# Altium schematic sheet 上电唤醒_Max706.SchDoc
size A4; DocumentNumber: 4; SheetNumber: 4; SheetTotal: 34
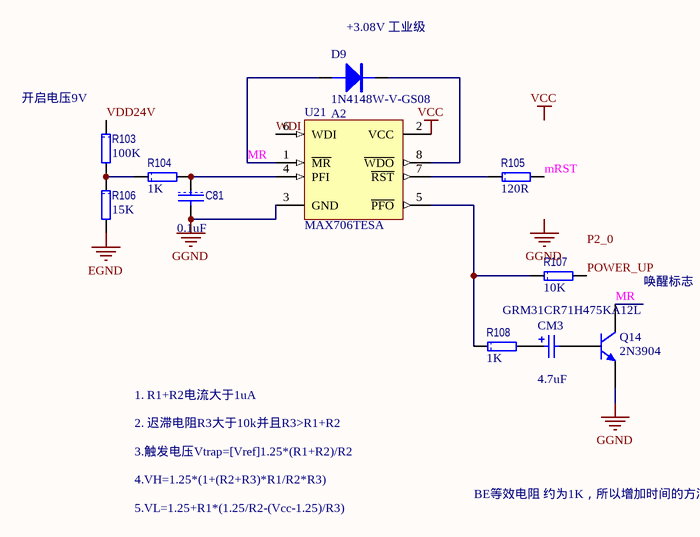
[diagram p0: 上电唤醒_Max706.SchDoc]

## Parts
C81  value 0.1uF  [1608[0603]C]  (hidden comment: C1608X7R1H104K)
CM3  GRM31CR71H475KA12L  value 4.7uF  [3216[1206]C]
D9  1N4148W-V-GS08  value A2  [SOD123]
Q14  2N3904  [SOT23_N]
R103  value 100K  [1608[0603]R]  (hidden comment: CRCW0603100KFKEA)
R104  value 1K  [1608[0603]R]  (hidden comment: CRCW06031K00FKEA)
R105  value 120R  [1608[0603]R]  (hidden comment: CRCW0603120RFKEA)
R106  value 15K  [1608[0603]R]  (hidden comment: CRCW060315K0FKEA)
R107  value 10K  [1608[0603]R]  (hidden comment: CRCW060310KFKEA)
R108  value 1K  [1608[0603]R]  (hidden comment: CRCW06031K00FKEA)
U21  MAX706TESA  [NSO8_N]

## Nets
EGND: R106.2
GGND: C81.2 Q14.1(E) U21.3(GND)
VCC: U21.2(VCC)
MR: D9.1(A) Q14.3(C) U21.1(~{MR})
mRST: R105.2
POWER_UP: R107.2
VDD24V: R103.1
WDI: U21.6(WDI)
NetC81_1: C81.1 R104.2 U21.4(PFI)
NetCM3_1: CM3.1 R108.2
NetCM3_2: CM3.2 Q14.2(B)
NetD9_2: D9.2(K) U21.8(~{WDO})
NetR103_2: R103.2 R104.1 R106.1
NetR105_1: R105.1 U21.7(~{RST})
NetR107_1: R107.1 R108.1 U21.5(~{PFO})

## Notes on the sheet
- (near D9) +3.08V 工业级
- (near R103) 开启电压9V
- 唤醒标志
- 1. R1+R2电流大于1uA
- 2. 迟滞电阻R3大于10k并且R3>R1+R2
- 3.触发电压Vtrap=[Vref]1.25*(R1+R2)/R2
- 4.VH=1.25*(1+(R2+R3)*R1/R2*R3)
- 5.VL=1.25+R1*(1.25/R2-(Vcc-1.25)/R3)
- BE等效电阻 约为1K，所以增加时间的方法只能同过增大电容
- Labels drawn without touching a wire or pin: GGND, P2_0, VCC

## Library data of the parts
C81 = CAP: 多层陶瓷电容器MLCC - SMD/SMT 0603 0.1uF 50volts X7R 10%; Manufacturer: TDK; 产品: General Type MLCCs; 产品种类: Low & Medium Capacitance SMD Ceramic Chip Capacitors; 外壳代码 - in: 0603; 外壳代码 - mm: 1608; 封装 / 箱体: 0603 (1608 metric); 封装: Reel; 尺寸: 0.8 mm W x 1.6 mm L x 0.8 mm H; 工作温度范围: - 55 C to + 125 C; 标准包装数量: 4000; 电压额定值: 50 V; 电容-nF: 100 nF; 电容-pF: 100000 pF; 系列: C; Category: 多层陶瓷电容器MLCC - SMD/SMT; ComponentLink1Description: http://www.tdk.com/pdf/general_B11.pdf; ComponentLink1URL: http://www.tdk.com/pdf/general_B11.pdf; Description 1: 多层陶瓷电容器MLCC - SMD/SMT 0603 0.1uF 50volts X7R 10%; Manufacturer Part Number: C1608X7R1H104K; Minimum Order Quantity: 1; Pricing 1: 1=0.160, 50=0.070, 100=0.036, 500=0.019, 1000=0.013, 4000=0.010, 8000=0.009, 12000=0.008, 20000=0.007 (USD); Reeling: True; RoHS - 贸泽: Y; RoHS: RoHS Compliant; Stock 1: 224604; Supplier 1: Mouser; Supplier Part Number 1: 810-C1608X7R1H104K; 制造商: TDK; 容差: 10 %; 温度系数/代码: X7R; 电容: 0.1 uF; 端接类型: SMD/SMT
CM3 = Cap Pol2: 多层陶瓷电容器MLCC - SMD/SMT 4.7uF 50Volts 10%; Manufacturer: Murata Electronics; 尺寸: 1.6 mm W x 3.2 mm L x 1.6 mm H; 工作温度范围: - 55 C to + 125 C; 封装 / 箱体: 1206 (3216 metric); 封装: Reel; 产品: General Type MLCCs; 系列: GRM; 电压额定值: 50 V; 电容-nF: 4700 nF; 外壳代码 - in: 1206; 外壳代码 - mm: 3216; 制造商: Murata; 标准包装数量: 2000; 温度系数/代码: X7R; Supplier 1: Mouser; Supplier Part Number 1: 81-GRM31CR71H475KA2L; Manufacturer Part Number: GRM31CR71H475KA12L; RoHS: RoHS Compliant; Description 1: 多层陶瓷电容器MLCC - SMD/SMT 4.7uF 50Volts 10%; Category: 多层陶瓷电容器MLCC - SMD/SMT; Stock 1: 57549; Pricing 1: 1=0.890, 10=0.561, 100=0.338, 1000=0.309, 2000=0.194, 10000=0.191, 24000=0.187, 50000=0.183 (USD); 电容: 4.7 uF; 端接类型: SMD/SMT; 容差: 10 %; RoHS - 贸泽: Y; Minimum Order Quantity: 1; Reeling: True; ComponentLink1URL: http://www.mouser.com/ds/2/281/product-244798.pdf; ComponentLink1Description: http://www.mouser.com/ds/2/281/product-244798.pdf
D9 = 1N4148W: 二极管 - 通用，功率，开关 100V Io/150mA; Manufacturer: Vishay Semiconductors; 配置: Single; 工作温度范围: - 65 C to + 150 C; 封装 / 箱体: SOD-123; 封装: Reel; 产品: Switching Diodes; 正向连续电流: 0.15 A; 最大浪涌电流: 0.5 A; 安装风格: SMD/SMT; 恢复时间: 4 ns; 正向电压下降: 1.2 V; 制造商: Vishay; 最大二极管电容: 4 pF; 最大工作温度: + 150 C; 最大功率耗散: 350 mW; 最大反向漏泄电流: 5 uA; 最小工作温度: - 65 C; 标准包装数量: 15000; Supplier 1: Mouser; Supplier Part Number 1: 625-1N4148W-V; Manufacturer Part Number: 1N4148W-V-GS08; RoHS: RoHS Compliant; Category: 二极管 - 通用，功率，开关; Stock 1: 404148; Pricing 1: 1=0.090, 10=0.083, 50=0.072, 100=0.068, 500=0.032, 1000=0.026, 3000=0.021, 9000=0.016, 10000=0.016, 18000=0.014 (USD); 峰值反向电压: 100 V; 产品种类: Switching Diodes; RoHS - 贸泽: Y; Minimum Order Quantity: 1; Reeling: True; ComponentLink1URL: http://www.mouser.com/ds/2/427/1n4148w--240387.pdf; ComponentLink1Description: http://www.mouser.com/ds/2/427/1n4148w--240387.pdf; Description 1: 二极管 - 通用，功率，开关 100V Io/150mA
Q14 = 2N3904: NPN General Purpose Amplifier; Published: 8-Jun-2000; LatestRevisionDate: 15-Jan-2003; LatestRevisionNote: PCB Footprint 'BCY-W3/D4.7' replaced; DatasheetVersion: 1997; PackageVersion: Sep-1998; PackageReference: TO-92A; Publisher: Altium Limited; PackageDescription: TO, Flat Index; 3 In-Line, Axial Leads; Body Dia. 4.5mm; Leads 0.51 x 0.48 mm (max); ComponentLink1Description: Manufacturer Link; ComponentLink1URL: http://www.fairchildsemi.com/; ComponentLink2Description: Datasheet; ComponentLink2URL: http://www.fairchildsemi.com/ds/2N%2F2N3904.pdf
R103 = RES: 厚膜电阻器 - SMD 1/10watt 100Kohms 1%; Manufacturer: Vishay / Dale; 尺寸: 0.85 mm W x 1.55 mm L x 0.45 mm H; 工作温度范围: - 55 C to + 155 C; 封装 / 箱体: 0603 (1608 metric); 封装: Reel; 功率额定值: 100 mW; 产品: Thick Film Resistors SMD; 系列: CRCW; 温度系数: 100 PPM / K; 端接类型: SMD/SMT; 电压额定值: 75 V; 制造商: Vishay; 产品种类: 0603 Thick Film Chip Resistors; 标准包装数量: 5000; 外壳代码 - in: 0603; 外壳代码 - mm: 1608; Supplier 1: Mouser; Supplier Part Number 1: 71-CRCW0603-100K-E3; Manufacturer Part Number: CRCW0603100KFKEA; RoHS: RoHS Compliant By Exemption; Category: 厚膜电阻器 - SMD; Stock 1: 175756; Pricing 1: 1=0.080, 10=0.013, 100=0.010, 1000=0.008, 5000=0.005, 25000=0.004, 50000=0.003 (USD); 电阻: 100 kOhms; 容差: 1 %; RoHS - 贸泽: E; Minimum Order Quantity: 1; Reeling: True; ComponentLink1URL: http://www.mouser.com/ds/2/427/dcrcwe3-109170.pdf; ComponentLink1Description: http://www.mouser.com/ds/2/427/dcrcwe3-109170.pdf; Description 1: 厚膜电阻器 - SMD 1/10watt 100Kohms 1%
R104 R108 = RES: 厚膜电阻器 - SMD 1/10watt 1.0Kohms 1%; Manufacturer: Vishay / Dale; 尺寸: 0.85 mm W x 1.55 mm L x 0.45 mm H; 工作温度范围: - 55 C to + 155 C; 封装 / 箱体: 0603 (1608 metric); 封装: Reel; 功率额定值: 100 mW; 产品: Thick Film Resistors SMD; 电阻: 1 kOhms; 系列: CRCW; 温度系数: 100 PPM / K; 端接类型: SMD/SMT; 电压额定值: 75 V; 制造商: Vishay; 产品种类: 0603 Thick Film Chip Resistors; 标准包装数量: 5000; 外壳代码 - in: 0603; 外壳代码 - mm: 1608; Supplier 1: Mouser; Supplier Part Number 1: 71-CRCW0603-1.0K-E3; Manufacturer Part Number: CRCW06031K00FKEA; RoHS: RoHS Compliant By Exemption; Category: 厚膜电阻器 - SMD; Stock 1: 276938; Pricing 1: 1=0.080, 10=0.013, 100=0.010, 1000=0.008, 5000=0.005, 25000=0.004, 50000=0.003 (USD); 容差: 1 %; RoHS - 贸泽: E; Minimum Order Quantity: 1; Reeling: True; ComponentLink1URL: http://www.mouser.com/ds/2/427/dcrcwe3-109170.pdf; ComponentLink1Description: http://www.mouser.com/ds/2/427/dcrcwe3-109170.pdf; Description 1: 厚膜电阻器 - SMD 1/10watt 1.0Kohms 1%
R105 = RES: 厚膜电阻器 - SMD 1/10watt 120ohms 1%; Manufacturer: Vishay / Dale; 尺寸: 0.85 mm W x 1.55 mm L x 0.45 mm H; 工作温度范围: - 55 C to + 155 C; 封装 / 箱体: 0603 (1608 metric); 封装: Reel; 功率额定值: 100 mW; 产品: Thick Film Resistors SMD; 系列: CRCW; 温度系数: 100 PPM / K; 端接类型: SMD/SMT; 电压额定值: 75 V; 外壳代码 - in: 0603; 外壳代码 - mm: 1608; 制造商: Vishay; 产品种类: 0603 Thick Film Chip Resistors; 标准包装数量: 5000; Supplier 1: Mouser; Supplier Part Number 1: 71-CRCW0603-120-E3; Manufacturer Part Number: CRCW0603120RFKEA; RoHS: RoHS Compliant By Exemption; Category: 厚膜电阻器 - SMD; Stock 1: 11148; Pricing 1: 1=0.080, 10=0.013, 100=0.010, 1000=0.008, 5000=0.005, 25000=0.004, 50000=0.003 (USD); 电阻: 120 Ohms; 容差: 1 %; RoHS - 贸泽: E; Minimum Order Quantity: 1; Reeling: True; ComponentLink1URL: http://www.mouser.com/ds/2/427/dcrcwe3-109170.pdf; ComponentLink1Description: http://www.mouser.com/ds/2/427/dcrcwe3-109170.pdf; Description 1: 厚膜电阻器 - SMD 1/10watt 120ohms 1%
R106 = RES: 厚膜电阻器 - SMD 1/10watt 15Kohms 1%
R107 = RES: 厚膜电阻器 - SMD 1/10watt 10Kohms 1%
U21 = MAX706TESA: +3V Voltage Monitoring, Low-Cost, µP Supervisory Circuit; Published: 16-Jan-2001; LatestRevisionDate: 13-Apr-2006; LatestRevisionNote: IPC-7351 Footprint Added.; DatasheetVersion: Sep-1995; PackageReference: NSO8; Publisher: Altium Limited; PackageDescription: 8-Pin Small Outline Integrated Circuit 1.27 mm Pitch; Code_JEDEC: MS-012-AA; Code_IPC: SOIC127P600-8; ComponentLink1Description: Manufacturer Link; ComponentLink1URL: http://www.maxim-ic.com/; ComponentLink2Description: Datasheet; ComponentLink2URL: http://pdfserv.maxim-ic.com/en/ds/MAX706P-MAX708T.pdf